# EAGLE schematic Final Schematic (EAGLE 6.5.0)
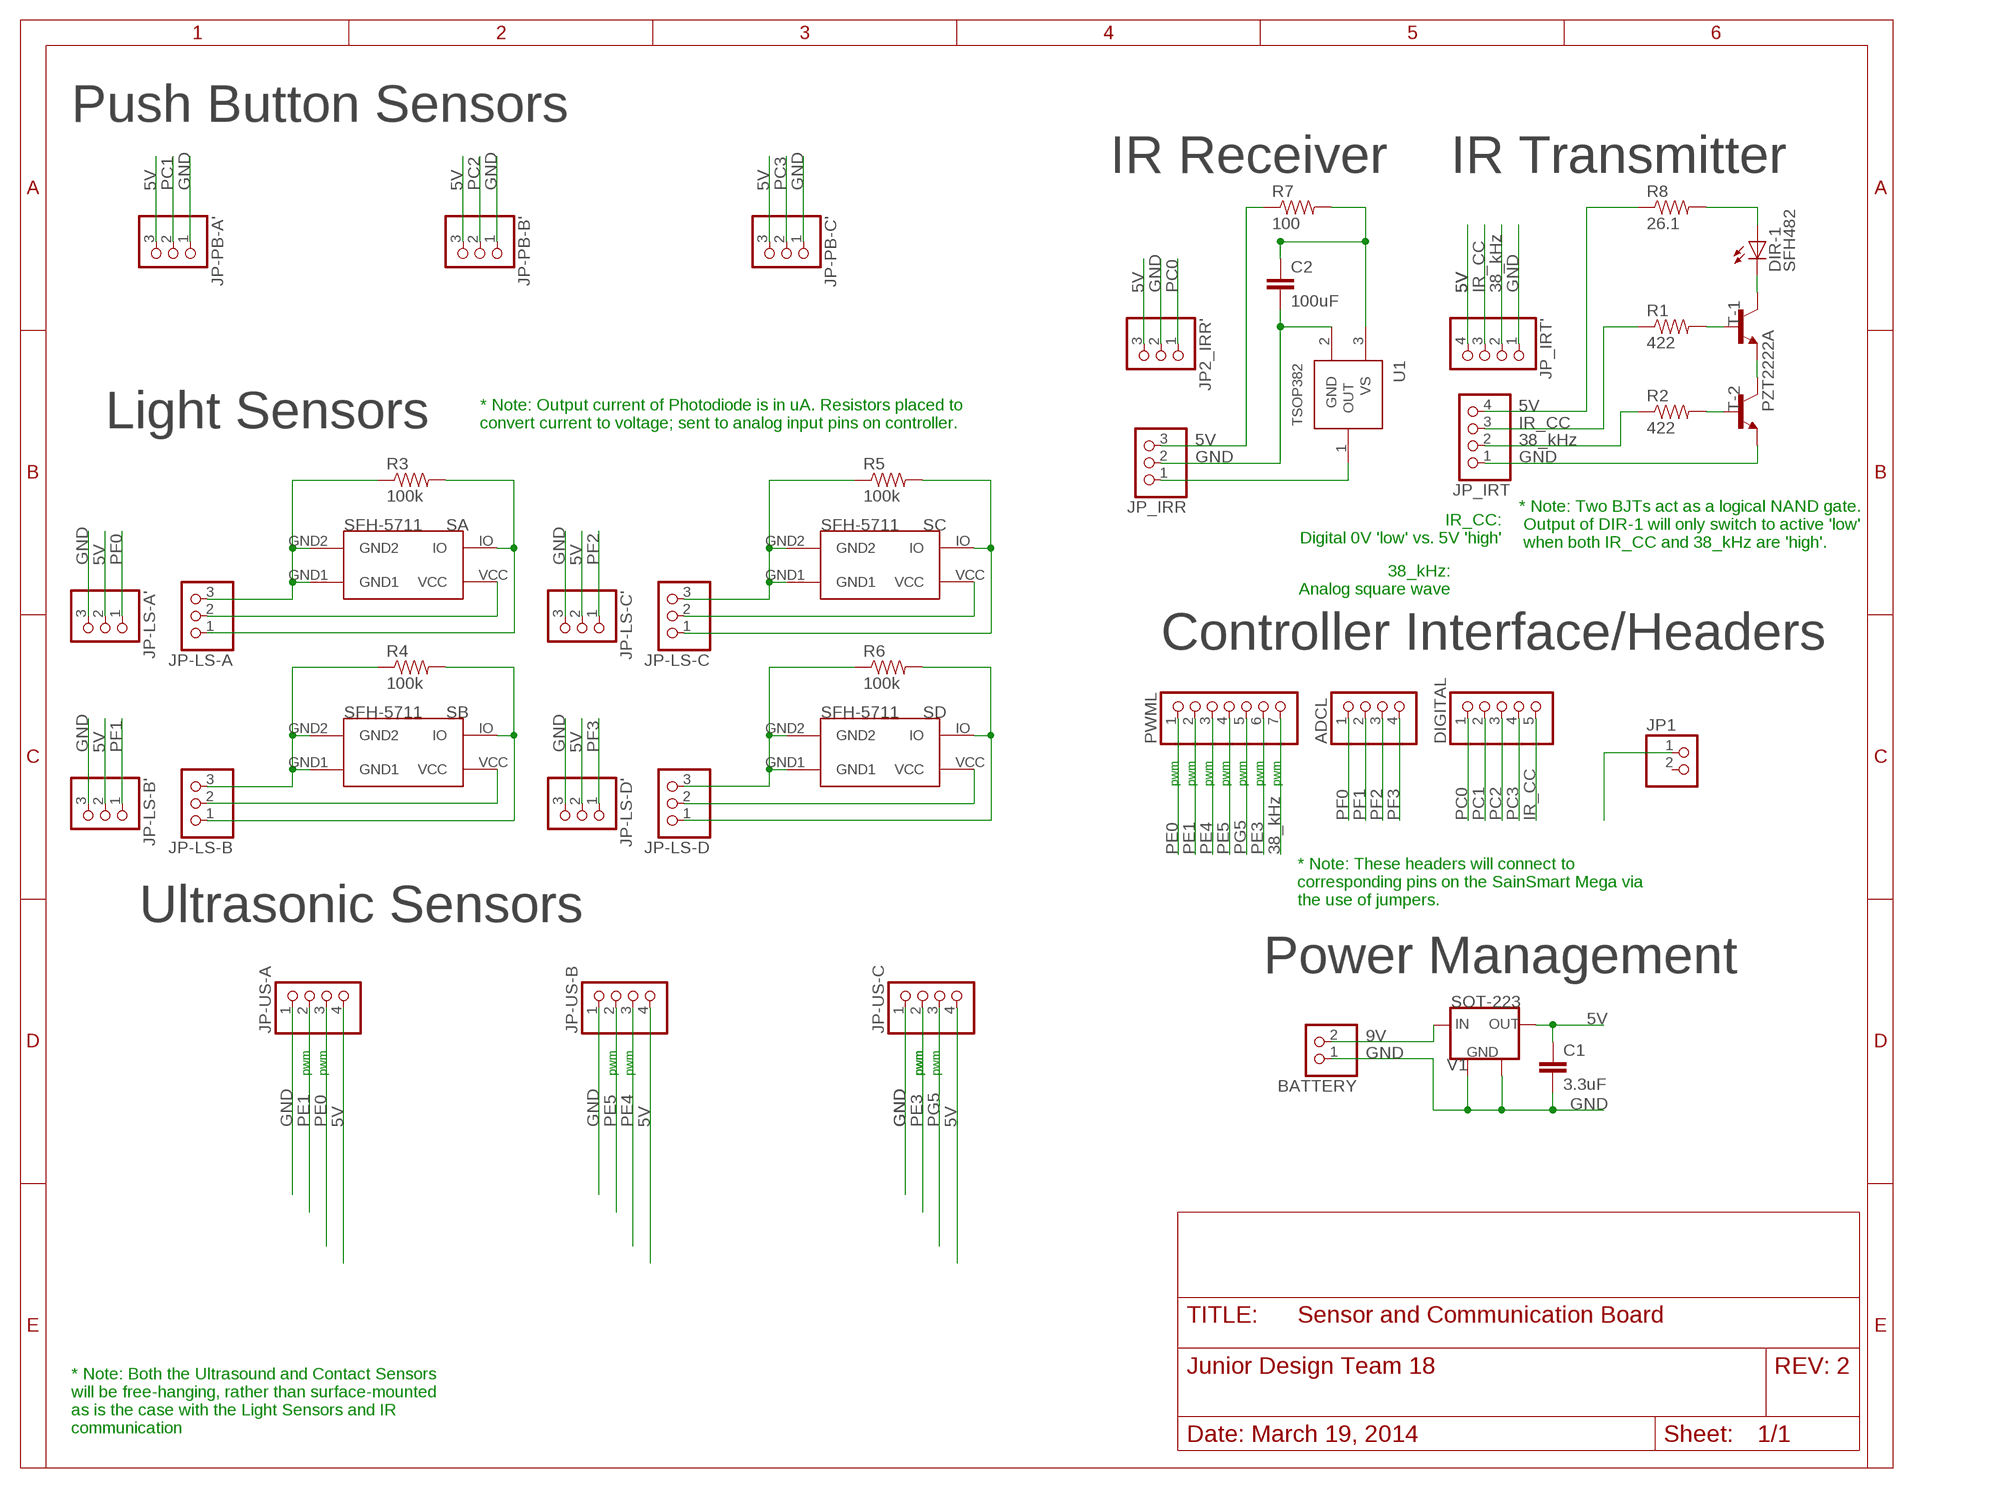
[diagram p0: schematic, sheet 1]

## Parts
ADCL  PINHD-1X4  [1X04]
BATTERY  PINHD-1X2  [1X02]
C1  3.3uF  CAP0603-CAP  [0603-CAP]
C2  100uF  CAP1206  [1206]
DIGITAL  PINHD-1X5  [1X05]
DIR-1  SFH482  [SFH482]
JP1  PINHD-1X2  [1X02]
JP2_IRR'  PINHD-1X3  [1X03]
JP-LS-A  PINHD-1X3  [1X03]
JP-LS-A'  PINHD-1X3  [1X03]
JP-LS-B  PINHD-1X3  [1X03]
JP-LS-B'  PINHD-1X3  [1X03]
JP-LS-C  PINHD-1X3  [1X03]
JP-LS-C'  PINHD-1X3  [1X03]
JP-LS-D  PINHD-1X3  [1X03]
JP-LS-D'  PINHD-1X3  [1X03]
JP-PB-A'  PINHD-1X3  [1X03]
JP-PB-B'  PINHD-1X3  [1X03]
JP-PB-C'  PINHD-1X3  [1X03]
JP-US-A  PINHD-1X4  [1X04]
JP-US-B  PINHD-1X4  [1X04]
JP-US-C  PINHD-1X4  [1X04]
JP_IRR  PINHD-1X3  [1X03]
JP_IRT  PINHD-1X4  [1X04]
JP_IRT'  PINHD-1X4  [1X04]
PWML  PINHD-1X7  [1X07]
R1  422  RESISTOR2512  [R2512]
R2  422  RESISTOR2512  [R2512]
R3  100k  RESISTOR0805-RES  [0805]
R4  100k  RESISTOR0805-RES  [0805]
R5  100k  RESISTOR0805-RES  [0805]
R6  100k  RESISTOR0805-RES  [0805]
R7  100  RESISTOR0805-RES  [0805]
R8  26.1  RESISTOR2512  [R2512]
SFH-5711-A  SA  SFH5711  [DIODE]
SFH-5711-B  SB  SFH5711  [DIODE]
SFH-5711-C  SC  SFH5711  [DIODE]
SFH-5711-D  SD  SFH5711  [DIODE]
SOT-223  V1  V_REG_LM1117SOT223  [SOT223]
T-1  PZT2222A  [SOT223]
T-2  PZT2222A  [SOT223]
U1  TSOP382  [TSOP382]

## Nets
5V: C1.1 JP2_IRR'.3 JP-LS-A'.2 JP-LS-B'.2 JP-LS-C'.2 JP-LS-D'.2 JP-PB-A'.3 JP-PB-B'.3 JP-PB-C'.3 JP-US-A.4 JP-US-B.4 JP-US-C.4 JP_IRT'.4 SOT-223.GND1(OUT)
GND: BATTERY.1 C1.2 JP1.1 JP2_IRR'.2 JP-LS-A'.3 JP-LS-B'.3 JP-LS-C'.3 JP-LS-D'.3 JP-PB-A'.1 JP-PB-B'.1 JP-PB-C'.1 JP-US-A.1 JP-US-B.1 JP-US-C.1 JP_IRT'.1 SOT-223.GND2(GND1) SOT-223.IN(GND2)
GND-IR-R: C2.2 JP_IRR.2 U1.2(GND)
GND-IR-T: JP_IRT.1 T-2.3(E)
GND-LS-A: JP-LS-A.3 R3.1 SFH-5711-A.GND1 SFH-5711-A.GND2
GND-LS-B: JP-LS-B.3 R4.1 SFH-5711-B.GND1 SFH-5711-B.GND2
GND-LS-C: JP-LS-C.3 R5.1 SFH-5711-C.GND1 SFH-5711-C.GND2
GND-LS-D: JP-LS-D.3 R6.1 SFH-5711-D.GND1 SFH-5711-D.GND2
IO-LS-A: JP-LS-A.1 R3.2 SFH-5711-A.IO
IO-LS-B: JP-LS-B.1 R4.2 SFH-5711-B.IO
IO-LS-C: JP-LS-C.1 R5.2 SFH-5711-C.IO
IO-LS-D: JP-LS-D.1 R6.2 SFH-5711-D.IO
IR_CC: DIGITAL.5 JP_IRT'.3
N$1: DIR-1.A R8.2
N$2: DIR-1.K(C) T-1.2(C) T-1.4(C)
N$3: BATTERY.2 SOT-223.OUT(IN)
N$4: R2.2 T-2.1(B)
N$5: R1.2 T-1.1(B)
N$6: T-1.3(E) T-2.2(C) T-2.4(C)
N$7: JP_IRT'.2 PWML.7
PC0: DIGITAL.1 JP2_IRR'.1
PC1: DIGITAL.2 JP-PB-A'.2
PC2: DIGITAL.3 JP-PB-B'.2
PC3: DIGITAL.4 JP-PB-C'.2
PE0: JP-US-A.3 PWML.1
PE1: JP-US-A.2 PWML.2
PE3: JP-US-C.2 PWML.6
PE4: JP-US-B.3 PWML.3
PE5: JP-US-B.2 PWML.4
PF0: ADCL.1 JP-LS-A'.1
PF1: ADCL.2 JP-LS-B'.1
PF2: ADCL.3 JP-LS-C'.1
PF3: ADCL.4 JP-LS-D'.1
PG5: JP-US-C.3 PWML.5
VCC-IR-R: JP_IRR.3 R7.1
VCC-IR-T: JP_IRT.4 R8.1
VCC-LS-A: JP-LS-A.2 SFH-5711-A.VCC
VCC-LS-B: JP-LS-B.2 SFH-5711-B.VCC
VCC-LS-C: JP-LS-C.2 SFH-5711-C.VCC
VCC-LS-D: JP-LS-D.2 SFH-5711-D.VCC
VIN-IR-1: JP_IRT.3 R1.1
VIN-IR-2: JP_IRT.2 R2.1
VOUT-IR-R: JP_IRR.1 U1.1(OUT)
VS-IR-R: C2.1 R7.2 U1.3(VS)
Unconnected: JP1.2

## Notes on the sheet
- Push Button Sensors
- IR Receiver | IR Transmitter
- 5V | PC1 | GND | 5V | PC2 | GND | 5V | PC3 | GND
- 5V | GND | PC0 | 5V | 5V | IR_CC | 38_kHz | GND
- 5V
- Light Sensors
- * Note: Output current of Photodiode is in uA. Resistors placed to
  convert current to voltage; sent to analog input pins on controller.
- IR_CC
- 5V | 38_kHz
- GND | GND
- IR_CC:
  Digital 0V 'low' vs. 5V 'high'
- SFH-5711 | SA | SFH-5711 | SC
- * Note: Two BJTs act as a logical NAND gate.
   Output of DIR-1 will only switch to active 'low'
   when both IR_CC and 38_kHz are 'high'.
- GND | 5V | PF0 | GND | 5V | PF2
- 38_kHz:
  Analog square wave
- Controller Interface/Headers
- SFH-5711 | SB | SFH-5711 | SD
- GND | 5V | PF1 | GND | 5V | PF3
- pwm | pwm | pwm | pwm | pwm | pwm | pwm
- IR_CC
- 38_kHz
- * Note: These headers will connect to
  corresponding pins on the SainSmart Mega via
  the use of jumpers.
- Ultrasonic Sensors
- Power Management
- 5V
- 9V
- GND
- pwm | pwm | pwm | pwm | pwm | pwm | pwm
- GND
- GND | PE1 | PE0 | 5V | GND | PE5 | PE4 | 5V | GND | GND | PE3 | PG5 | 5V
- * Note: Both the Ultrasound and Contact Sensors
  will be free-hanging, rather than surface-mounted
  as is the case with the Light Sensors and IR
  communication

## Library data of the parts
ADCL JP-US-A JP-US-B JP-US-C JP_IRT JP_IRT' = pinhead:PINHD-1X4: PIN HEADER
BATTERY JP1 = pinhead:PINHD-1X2: PIN HEADER
C1 C2 = beacon_board:CAP: Capacitor Standard 0603 ceramic capacitor, and 0.1" leaded capacitor.
DIGITAL = pinhead:PINHD-1X5: PIN HEADER
DIR-1 = led:SFH482: IR LED infrared emitting diode, Infineon
JP2_IRR' JP-LS-A JP-LS-A' JP-LS-B JP-LS-B' JP-LS-C JP-LS-C' JP-LS-D JP-LS-D' JP-PB-A' JP-PB-B' JP-PB-C' JP_IRR = pinhead:PINHD-1X3: PIN HEADER
PWML = pinhead:PINHD-1X7: PIN HEADER
R1-R8 = beacon_board:RESISTOR: Resistor Basic schematic elements and footprints for 0603, 1206, and PTH resistors.
SFH-5711-A SFH-5711-B SFH-5711-C SFH-5711-D = JDT-18:SFH5711: SFH 5711 - Photodiode with Built-In Current Amplifier
SOT-223 = JDT-18:V_REG_LM1117: Voltage Regulator LM1117 Standard adjustable voltage regulator but in SMD form. Spark Fun Electronics SKU : COM-00595
T-1 T-2 = beacon_board:PZT2222A
U1 = beacon_board:TSOP382: Vishay IR receiver module